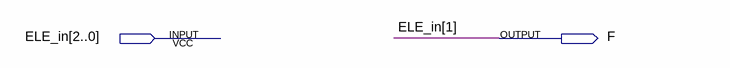
[diagram p0: schematic sheet]
// Quartus schematic DECOD_ELE_F.bdf as structural Verilog: 0 symbols, 2 pins
module DECOD_ELE_F (
  input  [2:0] ELE_in,
  output F
);


  assign F = ELE_in[1];
endmodule
